# EAGLE design NAND gate (EAGLE 6.5.0)
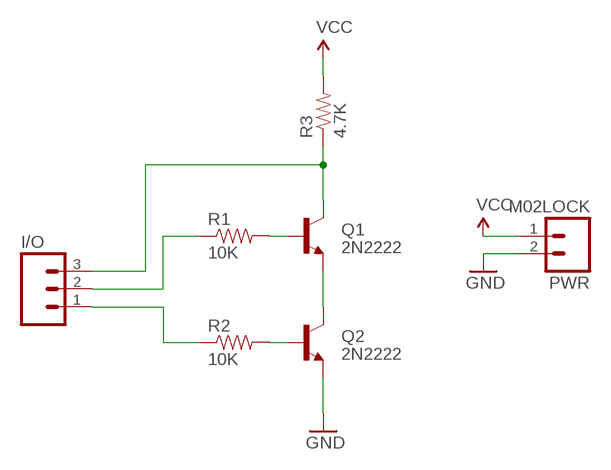
[diagram p0: schematic, sheet 1]

## Parts
I/O  M03LOCK  [1X03_LOCK]
PWR  M02LOCK  [1X02_LOCK]
Q1  2N2222  TRANSISTOR_NPNTO-92-AMMO  [TO-92-AMMO]
Q2  2N2222  TRANSISTOR_NPNTO-92-AMMO  [TO-92-AMMO]
R1  10K  RESISTORPTH-1/4W  [AXIAL-0.4]
R2  10K  RESISTORPTH-1/4W  [AXIAL-0.4]
R3  4.7K  RESISTORPTH-1/4W  [AXIAL-0.4]

## Nets
GND: PWR.2 Q2.1(E)
N$1: Q1.2(B) R1.P$2
N$2: Q2.2(B) R2.P$2
N$3: I/O.2 R1.P$1
N$4: I/O.1 R2.P$1
N$5: I/O.3 Q1.3(C) R3.P$1
N$6: Q1.1(E) Q2.3(C)
VCC: PWR.1 R3.P$2

## Library data of the parts
I/O = SparkFun-Connectors:M03: Header 3 Standard 3-pin 0.1" header. Use with straight break away headers (SKU : PRT-00116), right angle break away headers (PRT-00553), swiss pins (PRT-00743), machine pins (PRT-00117), and female headers (PRT-00115). Molex polarized connector foot print use with SKU : PRT-08232 with associated crimp pins and housings.
PWR = SparkFun-Connectors:M02: Standard 2-pin 0.1" header. Use with - straight break away headers ( PRT-00116) - right angle break away headers (PRT-00553) - swiss pins (PRT-00743) - machine pins (PRT-00117) - female headers (PRT-00115) Molex polarized connector foot print use with: PRT-08233 with associated crimp pins and housings. 2.54_SCREWTERM for use with PRT-10571. 3.5mm Screw Terminal footprints for PRT-08084 5mm Screw Terminal footprints for use with PRT-08433
Q1 Q2 = SparkFun-DiscreteSemi:TRANSISTOR_NPN: Generic NPN BJT MMBT2222A - TRANS-08049 (SOT-23, 1A 40V) MPSA42 - TRANS-09116 (SOT-23, 500mA 300V) MMBT5088LT1G - TRANS-11160 (SOT-23, 50 mA 30V)
R1-R3 = SparkFun-Passives:RESISTOR: Resistor Basic schematic elements and footprints for 0603, 1206, and PTH resistors.

## Board
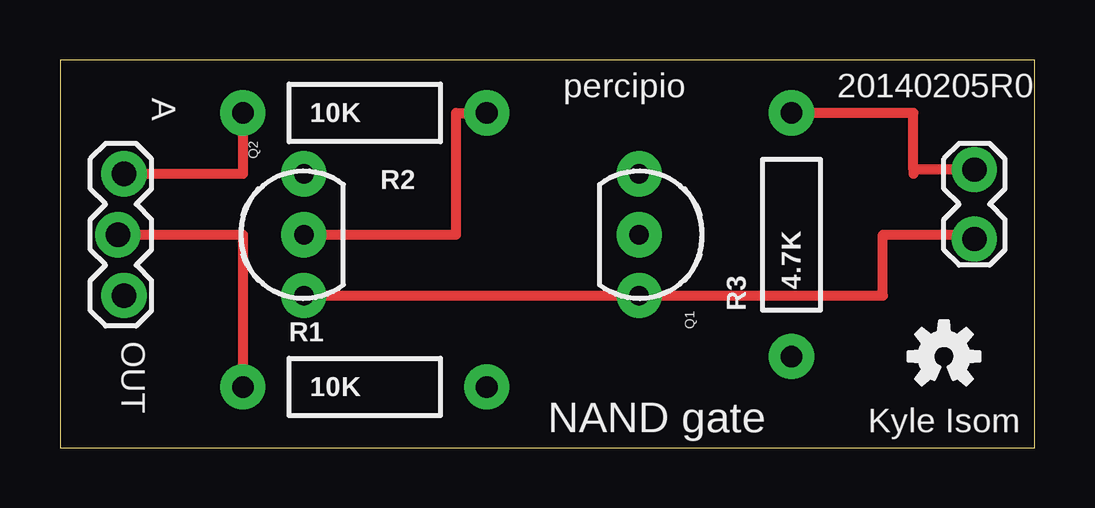
[diagram p1: board, top side]
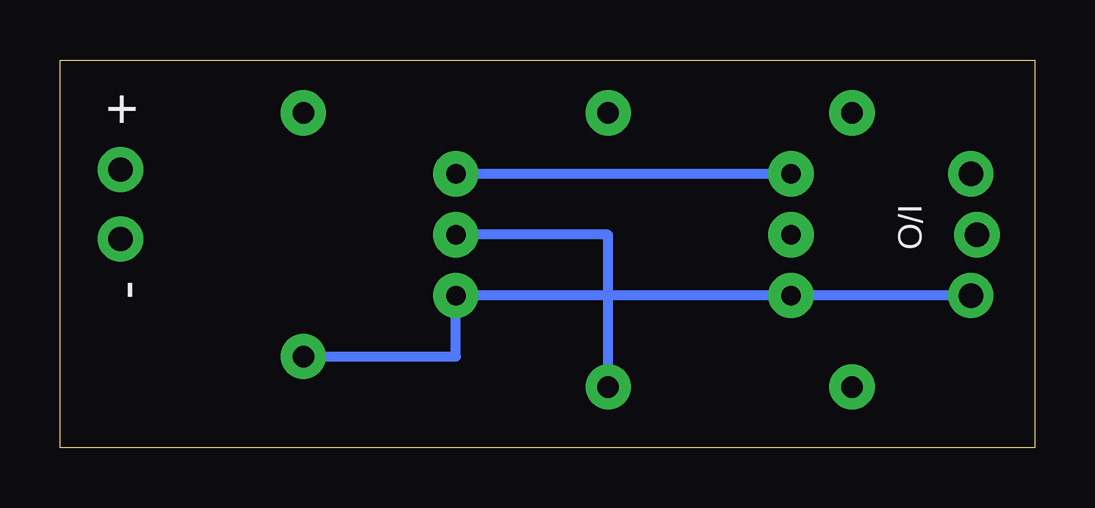
[diagram p2: board, bottom side, seen from below]

Size 40.62 x 16.18 mm. Coordinates in mm from the lower left corner, seen from the top.
Outline: 0,0 40.62,0 40.62,16.18 0,16.18 0,0
Copper layers (1*16): Top 0.035mm / dielectric 1.5mm / Bottom 0.035mm
Design rules "default": minimum track width 10mil, minimum drill 24mil, track to track 8mil, track to pad 8mil, pad to pad 8mil, via to via 8mil, smd to smd 8mil, copper to edge 40mil, drill to drill 8mil, minimum pad ring 10mil, minimum via ring 8mil, stop-mask expansion 4mil, vias tented up to drill 0mil, thermal gap 10mil

### Footprints (pad centres in the part's own frame; a part is rotated, then mirrored left to right if it is on the bottom)
1X03_LOCK = drill 1.016 pad 1.88: 1 0,0.127; 2 2.54,-0.127; 3 5.08,0.127
1X02_LOCK = drill 1.016 pad 1.88: 1 -0.178,0; 2 2.718,0
TO-92-AMMO = drill 0.813 pad 1.88: 1 -2.54,0; 2 0,0; 3 2.54,0
AXIAL-0.4 = drill 0.9 pad 1.88: P$1 -5.08,0; P$2 5.08,0

### Placement (x,y rotation side)
I/O  2.54,11.43 270 top
PWR  38.1,11.43 270 top
Q1  24.13,8.89 270 top
Q2  10.16,8.89 90 top
R1  12.7,2.54 0 top
R2  12.7,13.97 0 top
R3  30.48,8.89 90 top
U$1  [OSHW-LOGO-S]  36.83,3.81 0 top

### Tracks (layer width: path | path; a pad name or v marks a point on that pad's centre or on a via)
GND
  Top 0.406: Q2.1 34.29,6.35 34.29,8.89 38.1,8.89 PWR.2
N$1
  Bottom 0.406: R1.P$2 17.78,8.89 Q1.2
N$2
  Top 0.406: Q2.2 16.51,8.89 16.51,13.97 R2.P$2
N$3
  Top 0.406: I/O.2 7.62,8.89 R1.P$1
N$4
  Top 0.406: R2.P$1 7.62,11.43 I/O.1
N$5
  Bottom 0.406: I/O.3 Q1.3 24.13,3.81 R3.P$1
N$6
  Bottom 0.406: Q2.3 Q1.1
VCC
  Top 0.406: PWR.1 35.56,11.61 | 35.56,11.61 35.56,11.43 | 35.56,11.61 35.56,13.97 R3.P$2

### Text on the board
tPlace: A | percipio | 20140205R0 | OUT | NAND gate | Kyle Isom
bPlace: + | I/O | -